# Altium project STM_Analog_Ascii.PrjPcb
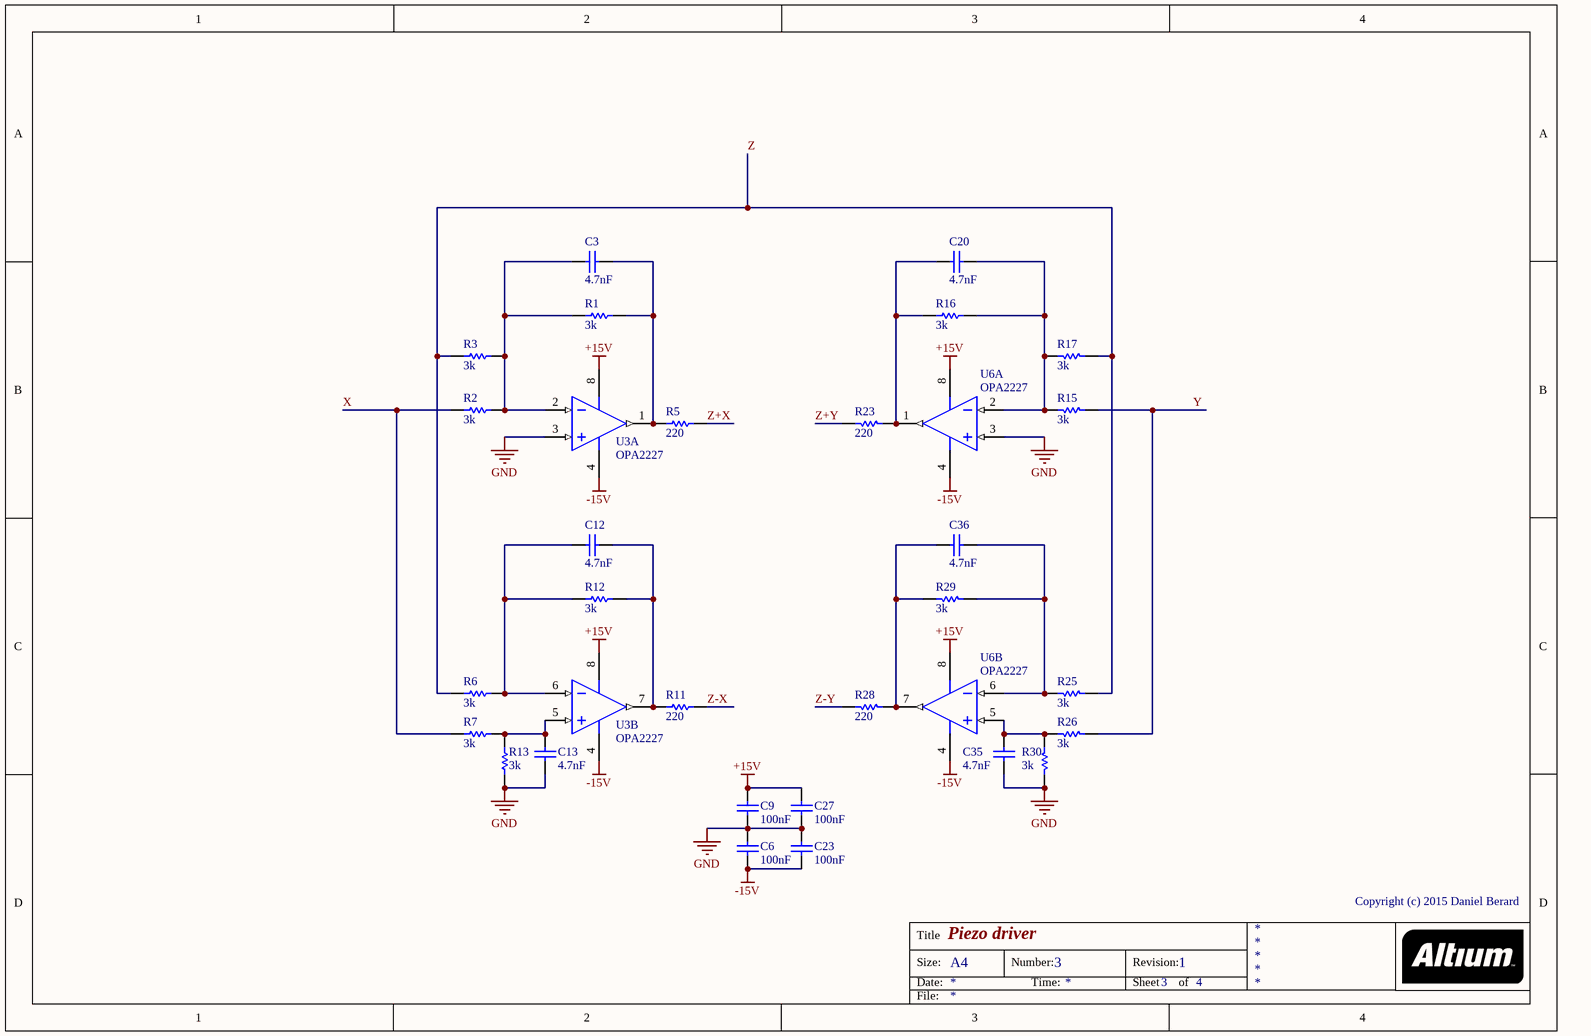
[diagram p0: Piezo Driver.SchDoc]
4 sheets, 136 parts. Net scope: global (net labels, ports and power ports of the same name join across sheets).
Board file: STM.PcbDoc
Sheets:
  Piezo Driver.SchDoc
  DAC.SchDoc
  ADC.SchDoc
  Connectors.SchDoc

## Sheet Piezo Driver.SchDoc: Piezo driver
size A4; DrawnBy: Daniel Berard; Engineer: Daniel Berard; DocumentNumber: 3; Revision: 1; SheetNumber: 3; SheetTotal: 4; ProjectName: STM

### Parts
C3  4.7nF  [6-0805_N]
C6  100nF  [6-0805_N]
C9  100nF  [6-0805_N]
C12  4.7nF  [6-0805_N]
C13  4.7nF  [6-0805_N]
C20  4.7nF  [6-0805_N]
C23  100nF  [6-0805_N]
C27  100nF  [6-0805_N]
C35  4.7nF  [6-0805_N]
C36  4.7nF  [6-0805_N]
R1  3k  [6-0805_N]
R2  3k  [6-0805_N]
R3  3k  [6-0805_N]
R5  220  [6-0805_N]
R6  3k  [6-0805_N]
R7  3k  [6-0805_N]
R11  220  [6-0805_N]
R12  3k  [6-0805_N]
R13  3k  [6-0805_N]
R15  3k  [6-0805_N]
R16  3k  [6-0805_N]
R17  3k  [6-0805_N]
R23  220  [6-0805_N]
R25  3k  [6-0805_N]
R26  3k  [6-0805_N]
R28  220  [6-0805_N]
R29  3k  [6-0805_N]
R30  3k  [6-0805_N]
U3  OPA2227  [ADI-R-8_M]  (parts A,B of 2)
U6  OPA2227  [ADI-R-8_M]  (parts A,B of 2)

### Nets
+15V: C9.2 C27.2 U3.8(+V) U6.8(+V)
-15V: C6.1 C23.1 U3.4(-V) U6.4(-V)
GND: C6.2 C9.1 C13.1 C23.2 C27.1 C35.1 R13.1 R30.1 U3.3(+IN_A) U6.3(+IN_A)
X: R2.1 R7.1
Y: R15.1 R26.1
Z: R3.1 R6.1 R17.1 R25.1
Z+X: R5.2
Z+Y: R23.2
Z-X: R11.2
Z-Y: R28.2
NetC3_1: C3.1 R1.1 R2.2 R3.2 U3.2(-IN_A)
NetC3_2: C3.2 R1.2 R5.1 U3.1(OUT_A)
NetC12_1: C12.1 R6.2 R12.1 U3.6(-IN_B)
NetC12_2: C12.2 R11.1 R12.2 U3.7(OUT_B)
NetC13_2: C13.2 R7.2 R13.2 U3.5(+IN_B)
NetC20_1: C20.1 R16.1 R23.1 U6.1(OUT_A)
NetC20_2: C20.2 R15.2 R16.2 R17.2 U6.2(-IN_A)
NetC35_2: C35.2 R26.2 R30.2 U6.5(+IN_B)
NetC36_1: C36.1 R28.1 R29.2 U6.7(OUT_B)
NetC36_2: C36.2 R25.2 R29.1 U6.6(-IN_B)

### Notes on the sheet
- Copyright (c) 2015 Daniel Berard
- Title
- Size:
- Date:
- A4
- Number:
- Time:
- Revision:
- Sheet
- of
- File:

### Library data of the parts
C3 C6 C9 C12 C13 C20 C23 C27 C35 C36 = Cap: Capacitor; Value: 100pF; Published: 8-Jun-2000; LatestRevisionDate: 17-Jul-2002; LatestRevisionNote: Re-released for DXP Platform.; PackageReference: RAD-0.3; Publisher: Altium Limited; PackageDescription: Radial Cap, Thru-Hole; 2 Leads; 0.3 in Pin Spacing
R1-R3 R5-R7 R11-R13 R15-R17 R23 R25 R26 R28-R30 = Res1: Resistor; Value: 1K; Published: 8-Jun-2000; LatestRevisionDate: 17-Jul-2002; LatestRevisionNote: Re-released for DXP Platform.; PackageReference: AXIAL-0.3; Publisher: Altium Limited; PackageDescription: Axial Device, Thru-Hole; 2 Leads; 0.3 in Pin Spacing
U3 U6 = CMP-0384-01147-2: Double Channel Wide Bandwidth Operational Amplifier, 10 MHz BW, 2.5 V/us SR, Industrial, 8-pin SOIC (R-8), Tube; Manufacturer: Analog Devices; Generic Part Number: AD8676; PartNumber: AD8676BRZ; V Span Min: 10V; Input Offset Voltage: 12uV; V Span Max: 36V; Iq/Amp: 2.7mA; Input Bias Current: 2.4nA; Small Signal Bandwidth: 10MHz; Amplifiers Per Package: 2; ComponentLink2Description: Datasheet; RevisionNote: Reference Circuit URL fixed; ComponentLink4URL: http://www.analog.com/en/all-operational-amplifiers-op-amps/operational-amplifiers-op-amps/ad8676/products/product.html#product-recommendations; Code_JEDEC: MS-012-AA; PackageDescription: 8-Pin Standard Small Outline Package, Body 3.9 x 4.9 mm, Pitch 1.27 mm; Mounting Technology: Surface Mount; Slew Rate: 2.5V/us; ComponentLink4Description: Reference Circuit; PackageVersion: 060506-A; ComponentLink1URL: http://www.analog.com/en/index.html; ComponentLink2URL: http://www.analog.com/static/imported-files/data_sheets/AD8676.pdf; ComponentLink1Description: Manufacturer URL; ComponentLink3Description: Package Specification; DatasheetVersion: Rev. C; ComponentLink3URL: http://www.analog.com/static/imported-files/packages/PKG_PDF/SOIC_Narrow%20(R)/R_8.pdf; PackageReference: R-8

## Sheet DAC.SchDoc: Analog outputs
size A3; DrawnBy: Daniel Berard; Engineer: Daniel Berard; DocumentNumber: 2; Revision: 1; SheetNumber: 2; SheetTotal: 4; ProjectName: STM
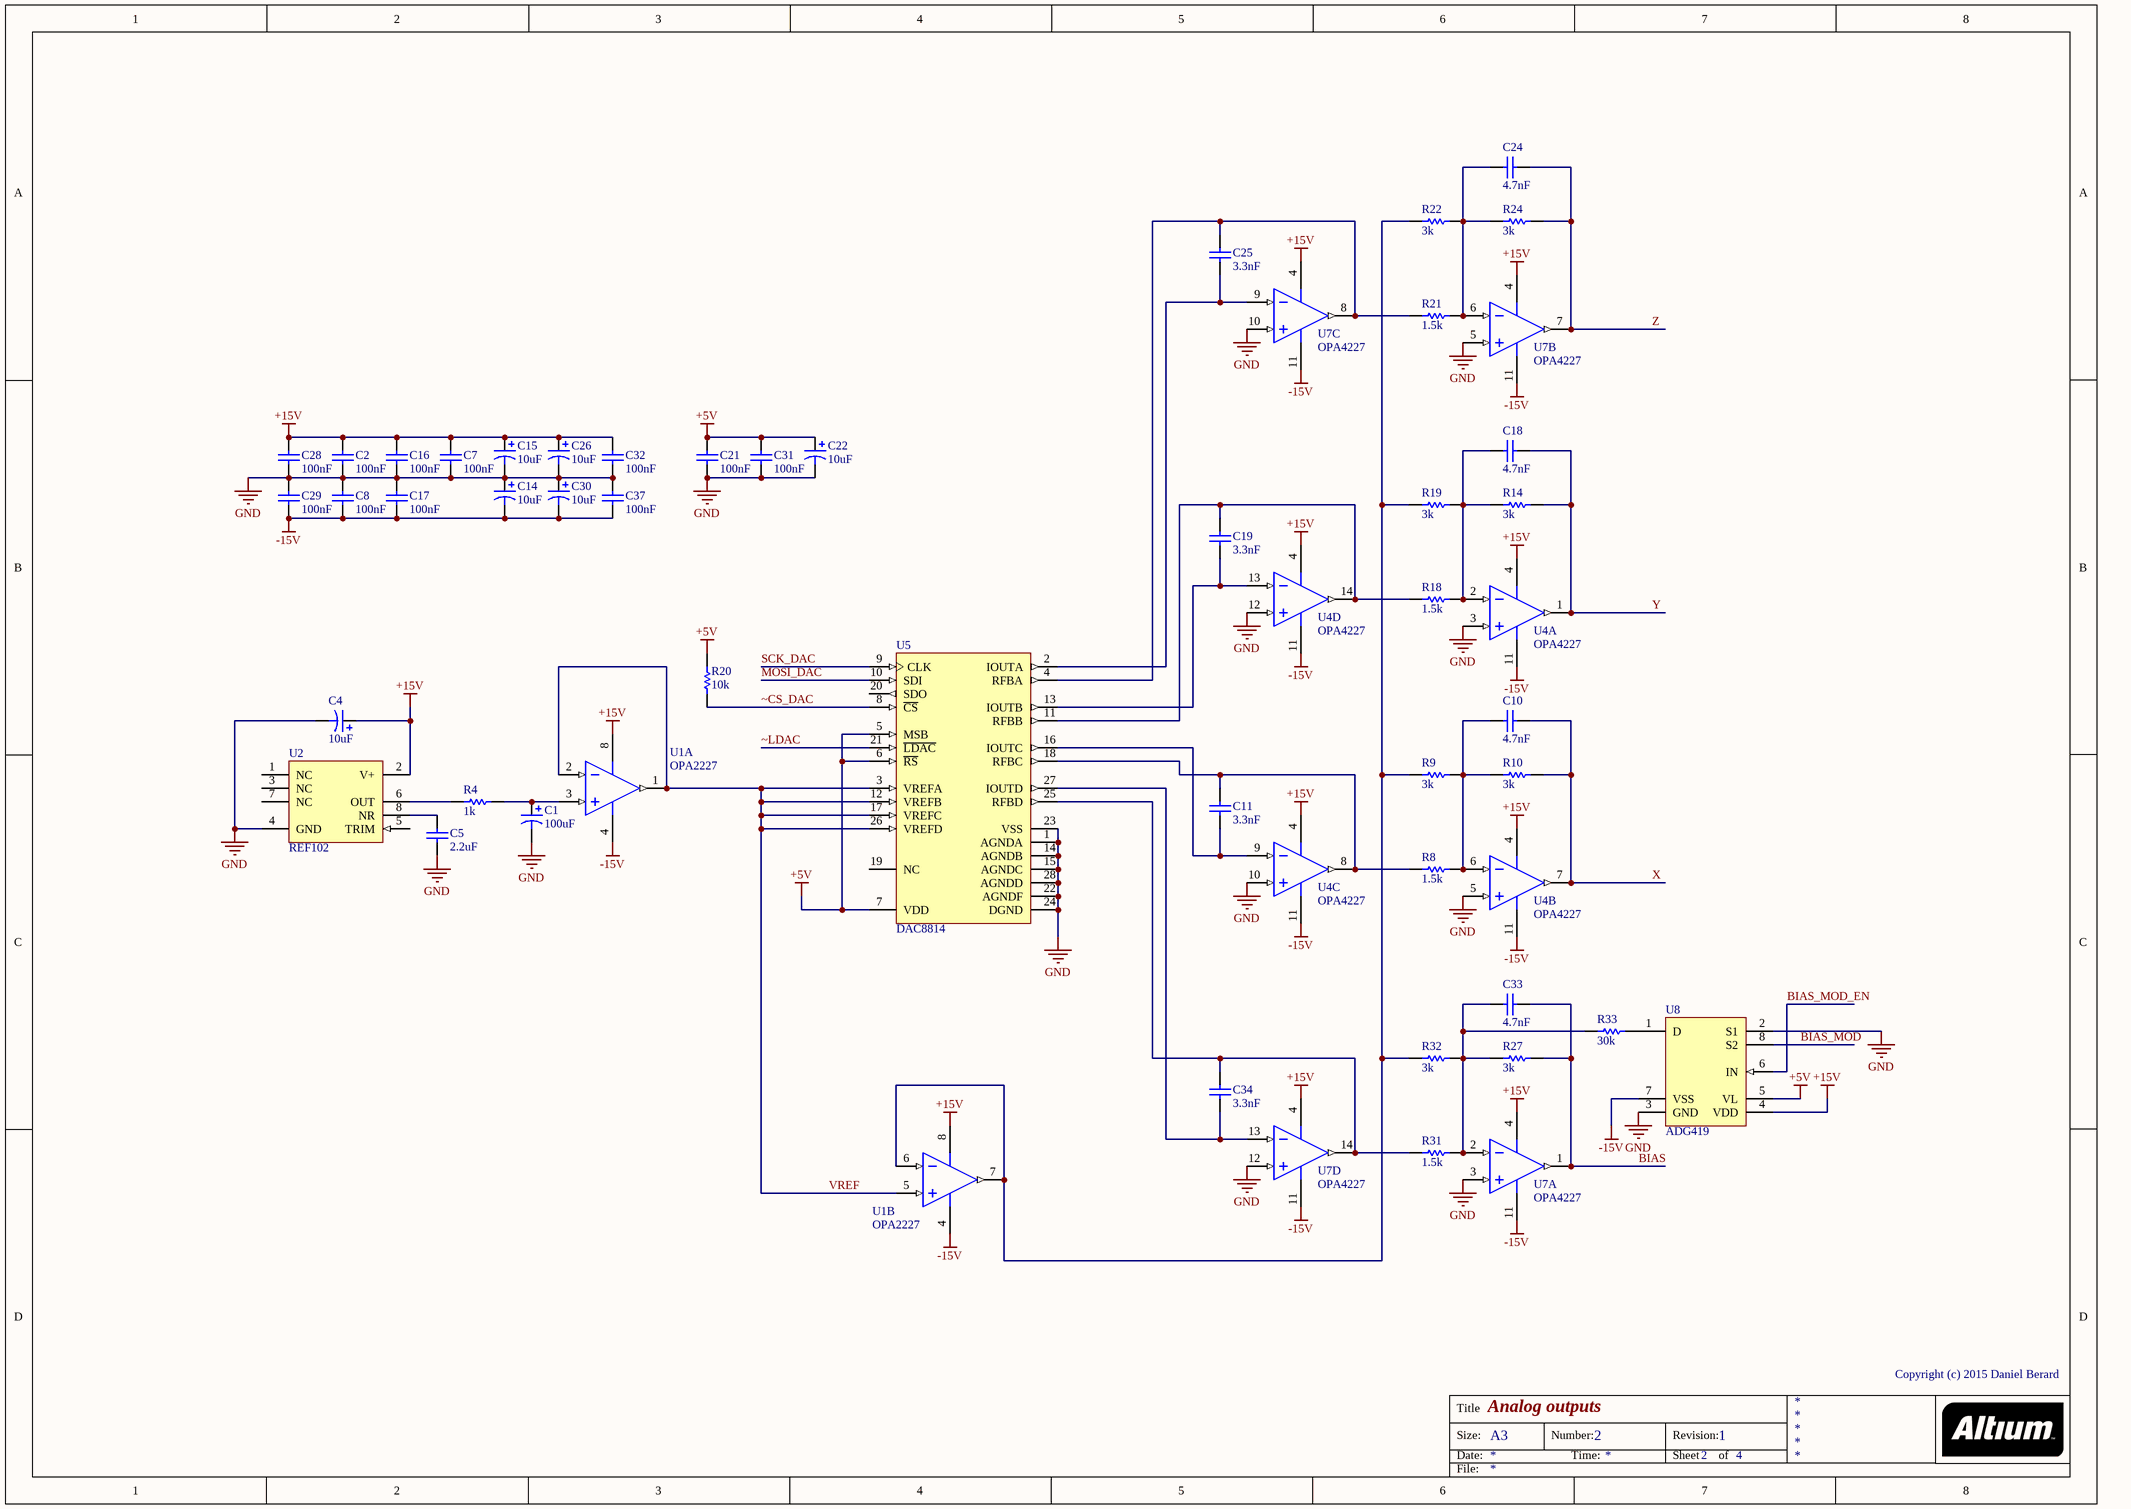
[diagram p1: DAC.SchDoc]

### Parts
C1  100uF  [7343]
C2  100nF  [6-0805_N]
C4  10uF  [3528]
C5  2.2uF  [C1206]
C7  100nF  [6-0805_N]
C8  100nF  [6-0805_N]
C10  4.7nF  [6-0805_N]
C11  3.3nF  [6-0805_N]
C14  10uF  [3528]
C15  10uF  [3528]
C16  100nF  [6-0805_N]
C17  100nF  [6-0805_N]
C18  4.7nF  [6-0805_N]
C19  3.3nF  [6-0805_N]
C21  100nF  [6-0805_N]
C22  10uF  [6-0805_N]
C24  4.7nF  [6-0805_N]
C25  3.3nF  [6-0805_N]
C26  10uF  [3528]
C28  100nF  [6-0805_N]
C29  100nF  [6-0805_N]
C30  10uF  [3528]
C31  100nF  [6-0805_N]
C32  100nF  [6-0805_N]
C33  4.7nF  [6-0805_N]
C34  3.3nF  [6-0805_N]
C37  100nF  [6-0805_N]
R4  1k  [6-0805_N]
R8  1.5k  [6-0805_N]
R9  3k  [6-0805_N]
R10  3k  [6-0805_N]
R14  3k  [6-0805_N]
R18  1.5k  [6-0805_N]
R19  3k  [6-0805_N]
R20  10k  [6-0805_N]
R21  1.5k  [6-0805_N]
R22  3k  [6-0805_N]
R24  3k  [6-0805_N]
R27  3k  [6-0805_N]
R31  1.5k  [6-0805_N]
R32  3k  [6-0805_N]
R33  30k  [6-0805_N]
U1  OPA2227  [ADI-R-8_M]  (parts A,B of 2)
U2  REF102  [182H_N]
U4  OPA4227  [TI-D14_M]  (parts A,B,C,D of 4)
U5  DAC8814  [TI-DB28_L]
U7  OPA4227  [TI-D14_M]  (parts A,B,C,D of 4)
U8  ADG419  [ADI-RM-8_N]

### Nets
+5V: C21.2 C22.1 C31.2 R20.2 U5.5(MSB) U5.6(~{RS}) U5.7(VDD) U8.5(VL)
+15V: C2.2 C4.1 C7.1 C15.1 C16.2 C26.1 C28.2 C32.2 U1.8(+V) U2.2(V+) U4.4(V+) U7.4(V+) U8.4(VDD)
-15V: C8.1 C14.2 C17.1 C29.1 C30.2 C37.1 U1.4(-V) U4.11(V-) U7.11(V-) U8.7(VSS)
GND: C1.2 C2.1 C4.2 C5.2 C7.2 C8.2 C14.1 C15.2 C16.1 C17.2 C21.1 C22.2 C26.2 C28.1 C29.2 C30.1 C31.1 C32.1 C37.2 U2.4(GND) U4.3(IN_A+) U4.5(IN_B+) U4.10(IN_C+) U4.12(IN_D+) U5.1(AGNDA) U5.14(AGNDB) U5.15(AGNDC) U5.22(AGNDF) U5.23(VSS) U5.24(DGND) U5.28(AGNDD) U7.3(IN_A+) U7.5(IN_B+) U7.10(IN_C+) U7.12(IN_D+) U8.2(S1) U8.3(GND)
BIAS: C33.2 R27.2 U7.1(OUT_A)
BIAS_MOD: U8.8(S2)
BIAS_MOD_EN: U8.6(IN)
MOSI_DAC: U5.10(SDI)
SCK_DAC: U5.9(CLK)
VREF: U1.1(OUT_A) U1.2(-IN_A) U1.5(+IN_B) U5.3(VREFA) U5.12(VREFB) U5.17(VREFC) U5.26(VREFD)
X: C10.2 R10.2 U4.7(OUT_B)
Y: C18.2 R14.2 U4.1(OUT_A)
Z: C24.2 R24.2 U7.7(OUT_B)
~CS_DAC: R20.1 U5.8(~{CS})
~LDAC: U5.21(~{LDAC})
NetC1_1: C1.1 R4.2 U1.3(+IN_A)
NetC5_1: C5.1 U2.8(NR)
NetC10_1: C10.1 R8.2 R9.2 R10.1 U4.6(IN_B-)
NetC11_1: C11.1 U4.9(IN_C-) U5.16(IOUTC)
NetC11_2: C11.2 R8.1 U4.8(OUT_C) U5.18(RFBC)
NetC18_1: C18.1 R14.1 R18.2 R19.2 U4.2(IN_A-)
NetC19_1: C19.1 U4.13(IN_D-) U5.13(IOUTB)
NetC19_2: C19.2 R18.1 U4.14(OUT_D) U5.11(RFBB)
NetC24_1: C24.1 R21.2 R22.2 R24.1 U7.6(IN_B-)
NetC25_1: C25.1 U5.2(IOUTA) U7.9(IN_C-)
NetC25_2: C25.2 R21.1 U5.4(RFBA) U7.8(OUT_C)
NetC33_1: C33.1 R27.1 R31.2 R32.2 R33.1 U7.2(IN_A-)
NetC34_1: C34.1 U5.27(IOUTD) U7.13(IN_D-)
NetC34_2: C34.2 R31.1 U5.25(RFBD) U7.14(OUT_D)
NetR4_1: R4.1 U2.6(OUT)
NetR9_1: R9.1 R19.1 R22.1 R32.1 U1.6(-IN_B) U1.7(OUT_B)
NetR33_2: R33.2 U8.1(D)

Not connected (* = marked no-connect by the designer): U2 1(NC) 3(NC) 5(TRIM) 7(NC); U5 19(NC) 20(SDO)

### Notes on the sheet
- Copyright (c) 2015 Daniel Berard
- Title
- Size:
- Date:
- A3
- Number:
- Time:
- Revision:
- Sheet
- of
- File:

### Library data of the parts
C1 C4 C14 C15 C22 C26 C30 = Cap Pol1: Polarized Capacitor (Radial); Value: 100pF; Published: 8-Jun-2000; LatestRevisionDate: 17-Jul-2002; LatestRevisionNote: Re-released for DXP Platform.; PackageReference: RB7.6-15; Publisher: Altium Limited; PackageDescription: Polarized Capacitor (Radial); 2 Leads
C2 C5 C7 C8 C10 C11 C16-C19 C21 C24 C25 C28 C29 C31-C34 C37 = Cap: Capacitor; Value: 100pF; Published: 8-Jun-2000; LatestRevisionDate: 17-Jul-2002; LatestRevisionNote: Re-released for DXP Platform.; PackageReference: RAD-0.3; Publisher: Altium Limited; PackageDescription: Radial Cap, Thru-Hole; 2 Leads; 0.3 in Pin Spacing
R4 = Res1: Resistor; Published: 8-Jun-2000; LatestRevisionDate: 17-Jul-2002; LatestRevisionNote: Re-released for DXP Platform.; PackageReference: AXIAL-0.3; Publisher: Altium Limited; PackageDescription: Axial Device, Thru-Hole; 2 Leads; 0.3 in Pin Spacing; Value: 1K
R8-R10 R14 R18-R22 R24 R27 R31-R33 = Res1: Resistor; Value: 1K; Published: 8-Jun-2000; LatestRevisionDate: 17-Jul-2002; LatestRevisionNote: Re-released for DXP Platform.; PackageReference: AXIAL-0.3; Publisher: Altium Limited; PackageDescription: Axial Device, Thru-Hole; 2 Leads; 0.3 in Pin Spacing
U1 = CMP-0384-01147-2: as U3 on sheet Piezo Driver; ComponentLink2Description: Datasheet; RevisionNote: Reference Circuit URL fixed; ComponentLink4URL: http://www.analog.com/en/all-operational-amplifiers-op-amps/operational-amplifiers-op-amps/ad8676/products/product.html#product-recommendations; Code_JEDEC: MS-012-AA; PackageDescription: 8-Pin Standard Small Outline Package, Body 3.9 x 4.9 mm, Pitch 1.27 mm; Mounting Technology: Surface Mount; Slew Rate: 2.5V/us; ComponentLink4Description: Reference Circuit; PackageVersion: 060506-A; ComponentLink1URL: http://www.analog.com/en/index.html; ComponentLink2URL: http://www.analog.com/static/imported-files/data_sheets/AD8676.pdf; ComponentLink1Description: Manufacturer URL; ComponentLink3Description: Package Specification; DatasheetVersion: Rev. C; ComponentLink3URL: http://www.analog.com/static/imported-files/packages/PKG_PDF/SOIC_Narrow%20(R)/R_8.pdf; PackageReference: R-8
U2 = REF102AU: Precision Voltage Reference; Note: Pins 1,3 and 7 are No internal Connection (NC) pins.; Published: 8-Jun-2000; LatestRevisionDate: 13-Apr-2006; LatestRevisionNote: IPC-7351 Footprint Added.; DatasheetVersion: Oct-1993; PackageReference: 182H; Publisher: Altium Limited; PackageDescription: 8-Pin Small Outline Integrated Circuit 1.27 mm Pitch; Code_JEDEC: MS-012-AA; Code_IPC: SOIC127P600-8; ComponentLink1Description: Manufacturer Link; ComponentLink1URL: http://www.ti.com/; ComponentLink2Description: Datasheet; ComponentLink2URL: http://www-s.ti.com/sc/ds/REF102.pdf
U4 U7 = CMP-0272-00152-2: High Precision, Low Noise Operational Amplifier, 5 to 36 V, -40 to 85 degC, 14-pin SOIC (D14), Green (RoHS & no Sb/Br); PartNumber: OPA4227UA/2K5; Manufacturer: Texas Instruments; Offset Drift(Typ)(uV/C): 0.3; Total Supply Voltage(Max)(+5V is 5, +/-5V is 10): 36; Vio (25C)(Max)(mV): 0.2; CMRR(Min)(dB): 120; Iq per channel(Max)(mA): 3.8; GBW(Typ)(MHz): 8; Number of Channels: 4; Rating: Catalog; IIB(Max)(pA): 10000; Slew Rate(Typ)(V/us): 2.3; Total Supply Voltage(Min)(+5V is 5, +/-5V is 10): 5; Packing: LARGE T&R; Sub Family: High Supply Voltage Amplifier (>=30V), Low Noise Amp (<=10nV/rtHz), Low Offset Voltage Amplifier (<=500uV), Precision Amplifier; PackageReference: D14; ComponentLink2Description: Datasheet; ComponentLink3URL: http://www.ti.com/lit/ml/mpds177g/mpds177g.pdf; Code_JEDEC: MS-012; DatasheetVersion: SBOS110A; Eco-Plan: Green (RoHS & no Sb/Br); ComponentLink3Description: Package Specification; ComponentLink2URL: http://www.ti.com/lit/ds/symlink/opa4227.pdf; ComponentLink1URL: http://www.ti.com/; Mounting Technology: Surface Mount; PackageDescription: 14-Pin Plastic Small Outline, Body 8.65 x 3.9 mm, Pitch 1.27 mm; PackageVersion: 4040047-5/M, 06/2011; ComponentLink1Description: Manufacturer URL
U5 = CMP-0004-00286-1: 16-Bit, Quad, Serial Input Multiplying Digital to Analog Converter, -40 to 85 degC, 28-pin SOP (DB28), Green (RoHS & no Sb/Br); Manufacturer: Texas Instruments; PartNumber: DAC8814ICDBTG4; Resolution(Bits): 16; DAC Channels: 4; SubFamily: Precision DAC (=<10MSPS); INL(Max)(+/-LSB): 1; Settling Time(us): 0.5; Interface: Serial SPI; Eco-Plan: Green (RoHS & no Sb/Br); PackageReference: DB28; ComponentLink1URL: http://www.ti.com/; DatasheetVersion: SBAS338D; PackageDescription: 28-Pin Plastic Small Outline, Body 10.2 X 5.3 mm, Pitch 0.65 mm; ComponentLink3Description: Package Specification; ComponentLink3URL: http://www.ti.com/lit/ml/msso002e/msso002e.pdf; ComponentLink2Description: Datasheet; Code_JEDEC: MO-150; ComponentLink2URL: http://www.ti.com/general/docs/lit/getliterature.tsp?genericPartNumber=DAC8814&fileType=pdf; ComponentLink1Description: Manufacturer URL; PackageVersion: 4040065/E, 12/2001; Mounting Technology: Surface Mount; DNL(Max)(+/-LSB): 1
U8 = CMP-0792-00196-1: LC2MOS Precision Mini-DIP Analog Switches, 25 Ohm Ron, 8-pin SOP (RM-8), Tube; Manufacturer: Analog Devices; PartNumber: ADG419BRMZ; Ron (ohms): 25, 40; Configuration: SPDT; Max Pos Supply: +16.5V; # Sw Functions: 1; Max Neg Supply: -16.5V; ComponentLink2Description: Datasheet; DatasheetVersion: Rev. C; Code_JEDEC: MO-187-AA; PackageVersion: Aug-05; ComponentLink1Description: Manufacturer URL; Mounting Technology: Surface Mount; ComponentLink3URL: http://www.analog.com/static/imported-files/packages/PKG_PDF/MSOP%28RM%29/RM_8.pdf; Packing: Tube; ComponentLink1URL: http://www.analog.com/en/index.html; ComponentLink3Description: Package Specification; PackageDescription: 8-Pin Mini Small Outline Package, Body 3 x 3 mm, Pitch 0.65 mm; PackageReference: RM-8; ComponentLink2URL: http://www.analog.com/static/imported-files/data_sheets/ADG419.pdf

## Sheet ADC.SchDoc: Data acquisition
size A4; DrawnBy: Daniel Berard; Engineer: Daniel Berard; DocumentNumber: 1; Revision: 1; SheetNumber: 1; SheetTotal: 4; ProjectName: STM
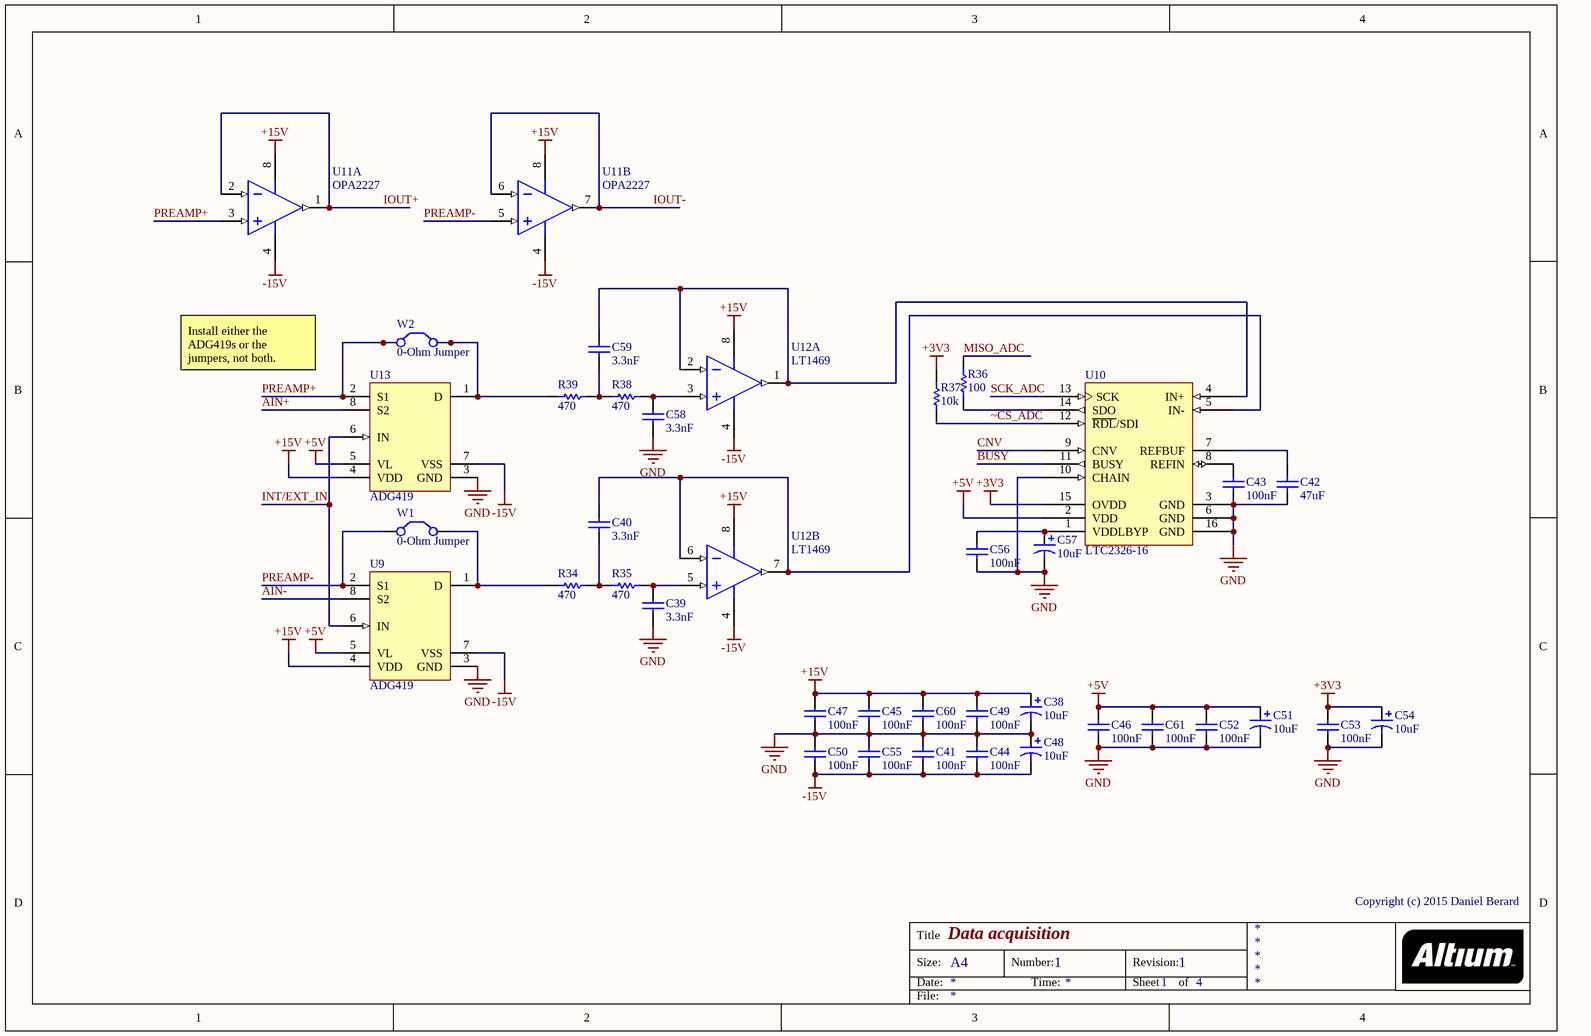
[diagram p2: ADC.SchDoc]

### Parts
C38  10uF  [3528]
C39  3.3nF  [6-0805_N]
C40  3.3nF  [6-0805_N]
C41  100nF  [6-0805_N]
C42  47uF  [C1210]
C43  100nF  [6-0805_N]
C44  100nF  [6-0805_N]
C45  100nF  [6-0805_N]
C46  100nF  [6-0805_N]
C47  100nF  [6-0805_N]
C48  10uF  [3528]
C49  100nF  [6-0805_N]
C50  100nF  [6-0805_N]
C51  10uF  [6-0805_N]
C52  100nF  [6-0805_N]
C53  100nF  [6-0805_N]
C54  10uF  [6-0805_N]
C55  100nF  [6-0805_N]
C56  100nF  [6-0805_N]
C57  10uF  [6-0805_N]
C58  3.3nF  [6-0805_N]
C59  3.3nF  [6-0805_N]
C60  100nF  [6-0805_N]
C61  100nF  [6-0805_N]
R34  470  [6-0805_N]
R35  470  [6-0805_N]
R36  100  [6-0805_N]
R37  10k  [6-0805_N]
R38  470  [6-0805_N]
R39  470  [6-0805_N]
U9  ADG419  [ADI-RM-8_N]
U10  LTC2326-16  [MSOP-16]
U11  OPA2227  [TI-D8_N]  (parts A,B of 2)
U12  LT1469  [LT-S8-8_N]  (parts A,B of 2)
U13  ADG419  [ADI-RM-8_N]
W1  0-Ohm Jumper  [6-0805_N]
W2  0-Ohm Jumper  [6-0805_N]

### Nets
+3V3: C53.2 C54.1 R37.2 U10.15(OVDD)
+5V: C46.2 C51.1 C52.2 C61.2 U9.5(VL) U10.2(VDD) U13.5(VL)
+15V: C38.1 C45.2 C47.2 C49.2 C60.2 U9.4(VDD) U11.8(V+) U12.8(V+) U13.4(VDD)
-15V: C41.1 C44.1 C48.2 C50.1 C55.1 U9.7(VSS) U11.4(V-) U12.4(V-) U13.7(VSS)
GND: C38.2 C39.2 C41.2 C42.1 C43.1 C44.2 C45.1 C46.1 C47.1 C48.1 C49.1 C50.2 C51.2 C52.1 C53.1 C54.2 C55.2 C56.1 C57.2 C58.2 C60.1 C61.1 U9.3(GND) U10.3(GND) U10.6(GND) U10.10(CHAIN) U10.16(GND) U13.3(GND)
AIN+: U13.8(S2)
AIN-: U9.8(S2)
BUSY: U10.11(BUSY)
CNV: U10.9(CNV)
INT/EXT_IN: U9.6(IN) U13.6(IN)
IOUT+: U11.1(OUT_A) U11.2(IN_A-)
IOUT-: U11.6(IN_B-) U11.7(OUT_B)
MISO_ADC: R36.1
PREAMP+: U11.3(IN_A+) U13.2(S1) W2.1(C1)
PREAMP-: U9.2(S1) U11.5(IN_B+) W1.1(C1)
SCK_ADC: U10.13(SCK)
~CS_ADC: R37.1 U10.12(~{RDL}/SDI)
NetC39_1: C39.1 R35.2 U12.5(+IN_B)
NetC40_1: C40.1 U10.5(IN-) U12.6(-IN_B) U12.7(OUT_B)
NetC40_2: C40.2 R34.2 R35.1
NetC42_2: C42.2 U10.7(REFBUF)
NetC43_2: C43.2 U10.8(REFIN)
NetC56_2: C56.2 C57.1 U10.1(VDDLBYP)
NetC58_1: C58.1 R38.2 U12.3(+IN_A)
NetC59_1: C59.1 U10.4(IN+) U12.1(OUT_A) U12.2(-IN_A)
NetC59_2: C59.2 R38.1 R39.2
NetR34_1: R34.1 U9.1(D) W1.2(C2)
NetR36_2: R36.2 U10.14(SDO)
NetR39_1: R39.1 U13.1(D) W2.2(C2)

### Notes on the sheet
- Install either the ADG419s or the jumpers, not both.
- Copyright (c) 2015 Daniel Berard
- Title
- Size:
- Date:
- A4
- Number:
- Time:
- Revision:
- Sheet
- of
- File:

### Library data of the parts
C38 C48 C51 C54 C57 = Cap Pol1: as C1 on sheet DAC; Published: 8-Jun-2000; LatestRevisionDate: 17-Jul-2002; LatestRevisionNote: Re-released for DXP Platform.; PackageReference: RB7.6-15; Publisher: Altium Limited; PackageDescription: Polarized Capacitor (Radial); 2 Leads
C39-C47 C49 C50 C52 C53 C55 C56 C58-C61 = Cap: Capacitor; Value: 100pF; Published: 8-Jun-2000; LatestRevisionDate: 17-Jul-2002; LatestRevisionNote: Re-released for DXP Platform.; PackageReference: RAD-0.3; Publisher: Altium Limited; PackageDescription: Radial Cap, Thru-Hole; 2 Leads; 0.3 in Pin Spacing
R34-R39 = Res1: Resistor; Value: 1K; Published: 8-Jun-2000; LatestRevisionDate: 17-Jul-2002; LatestRevisionNote: Re-released for DXP Platform.; PackageReference: AXIAL-0.3; Publisher: Altium Limited; PackageDescription: Axial Device, Thru-Hole; 2 Leads; 0.3 in Pin Spacing
U9 U13 = CMP-0792-00196-1: as U8 on sheet DAC; ComponentLink2Description: Datasheet; DatasheetVersion: Rev. C; Code_JEDEC: MO-187-AA; PackageVersion: Aug-05; ComponentLink1Description: Manufacturer URL; Mounting Technology: Surface Mount; ComponentLink3URL: http://www.analog.com/static/imported-files/packages/PKG_PDF/MSOP%28RM%29/RM_8.pdf; Packing: Tube; ComponentLink1URL: http://www.analog.com/en/index.html; ComponentLink3Description: Package Specification; PackageDescription: 8-Pin Mini Small Outline Package, Body 3 x 3 mm, Pitch 0.65 mm; PackageReference: RM-8; ComponentLink2URL: http://www.analog.com/static/imported-files/data_sheets/ADG419.pdf
U11 = CMP-0272-00267-2: High Precision, Low Noise Operational Amplifier, 5 to 36 V, -40 to 85 degC, 8-pin SOIC (D8), Green (RoHS & no Sb/Br); Manufacturer: Texas Instruments; PartNumber: OPA2227U/2K5; Rating: Catalog; Number of Channels: 2; IIB(Max)(pA): 10000; Packing: LARGE T&R; Total Supply Voltage(Max)(+5V is 5, +/-5V is 10): 36; GBW(Typ)(MHz): 8; CMRR(Min)(dB): 120; Offset Drift(Typ)(uV/C): 0.1; Iq per channel(Max)(mA): 3.8; Slew Rate(Typ)(V/us): 2.3; Total Supply Voltage(Min)(+5V is 5, +/-5V is 10): 5; Vio (25C)(Max)(mV): 0.075; Sub Family: High Supply Voltage Amplifier (>=30V), Low Noise Amp (<=10nV/rtHz), Low Offset Voltage Amplifier (<=500uV), Precision Amplifier; ComponentLink2URL: http://www.ti.com/lit/ds/symlink/opa2227.pdf; ComponentLink3Description: Package Specification; PackageDescription: 8-Pin Plastic Small Outline, Body 4.9 x 3.9 mm, Pitch 1.27 mm; Code_JEDEC: MS-012; PackageReference: D8; PackageVersion: 4040047-3/M, 06/2011; Mounting Technology: Surface Mount; DatasheetVersion: SBOS110A; ComponentLink2Description: Datasheet; ComponentLink3URL: http://www.ti.com/litv/pdf/msoi002j; ComponentLink1URL: http://www.ti.com/; Eco-Plan: Green (RoHS & no Sb/Br); ComponentLink1Description: Manufacturer URL
U12 = CMP-0359-02956-2: Dual Channel, 16-Bit Accurate Operational Amplifier, 200 MHz Typical GBW, 30 V/us Typical SR, 10 to 36 V, 8-Pin SOIC (S8-8), Commercial, Pb-Free; Linear Technology Part Number: LT1469-2; PartNumber: LT1469CS8-2#PBF; Manufacturer: Linear Technology; Vos (mV) Typical: 0.05; GBW (MHz) Typical: 200; Vs Min (V): 10; Channels (#): 2; Is (mA) Typical: 4.1; Vs Max (V): 36; SR (V/us) Typical: 30; ComponentLink1Description: Manufacturer URL; ComponentLink2Description: Datasheet; ComponentLink1URL: http://www.linear.com/; PackageReference: LT-S8-8; RoHS: Pb-Free; Mounting Technology: Surface Mount; Type: VFB; PackageDescription: 8-Pin Plastic Small Outline, Body 4.9 x 3.9 mm, Pitch 1.27 mm; PackageVersion: Rev G; ComponentLink3Description: Package Specification; ComponentLink2URL: http://cds.linear.com/docs/en/datasheet/14692f.pdf; ComponentLink3URL: http://cds.linear.com/docs/en/packaging/05081610_G_SO8.pdf; RevisionNote: URLs updated
W1 W2 = Jumper: Jumper Wire; Published: 24-Mar-1999; LatestRevisionDate: 17-Jul-2002; LatestRevisionNote: Re-released for DXP Platform.; PackageReference: RAD-0.2; Publisher: Altium Limited; PackageDescription: Radial Cap, Thru-Hole; 2 Leads; 0.2 in Pin Spacing

## Sheet Connectors.SchDoc: Connectors and power filtering
size A4; Author: Daniel Berard; DrawnBy: Daniel Berard; Engineer: Daniel Berard; DocumentNumber: 4; Revision: 1; SheetNumber: 4; SheetTotal: 4; ProjectName: STM
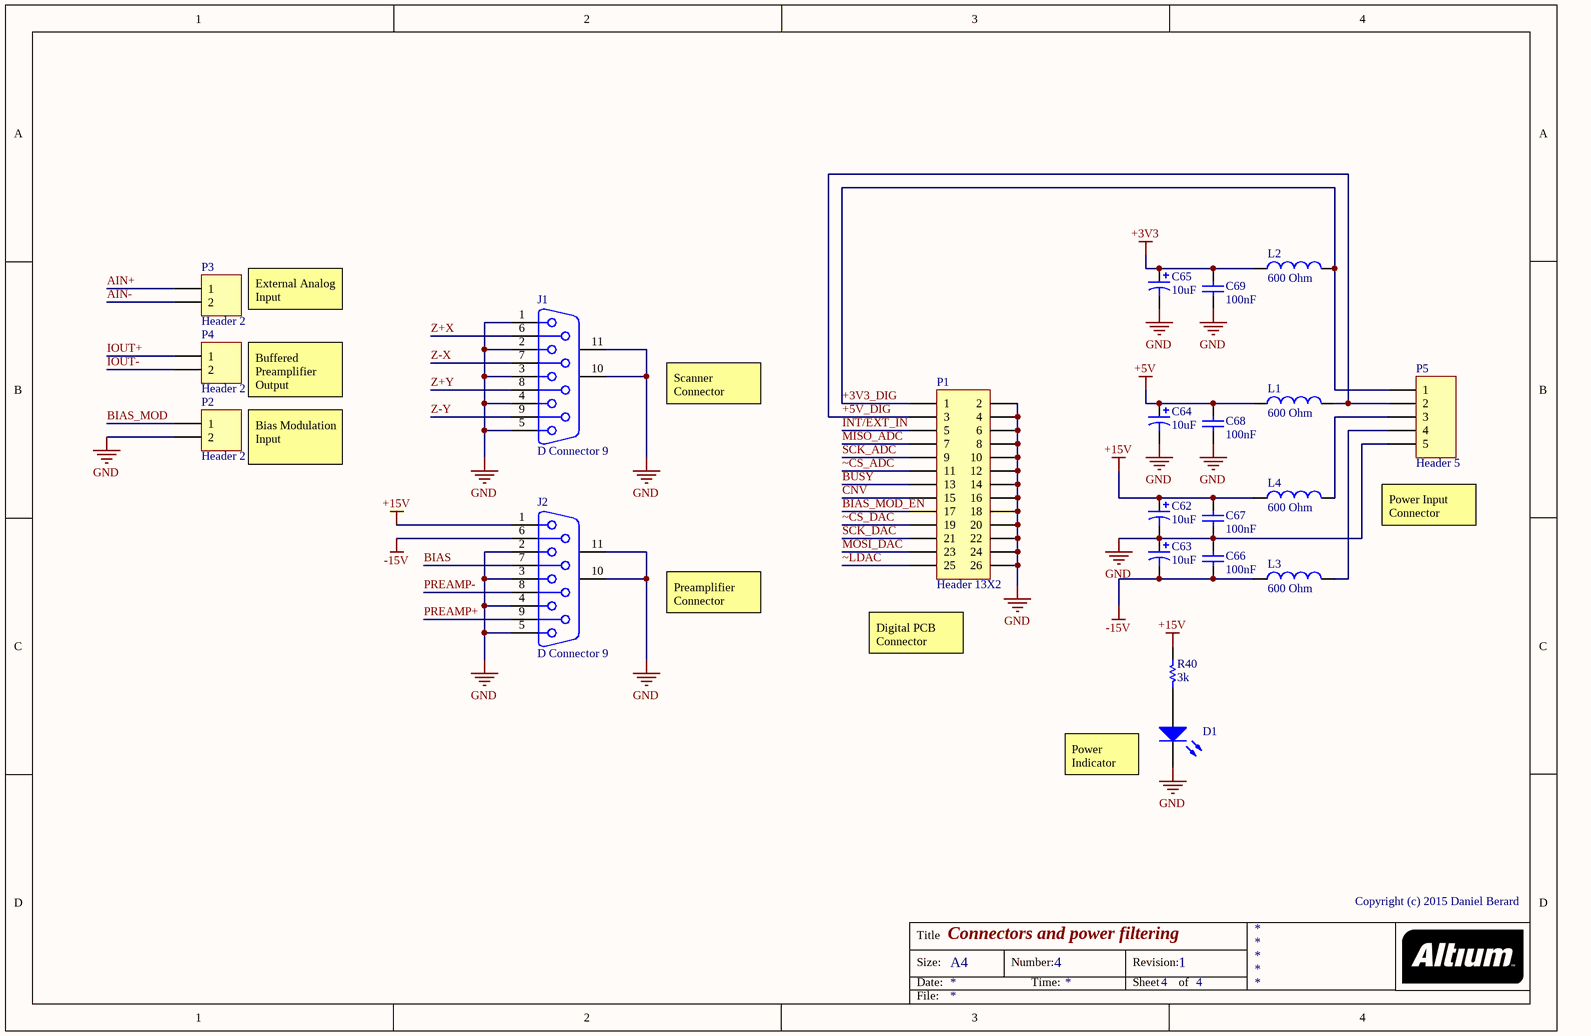
[diagram p3: Connectors.SchDoc]

### Parts
C62  10uF  [3528]
C63  10uF  [3528]
C64  10uF  [6-0805_N]
C65  10uF  [6-0805_N]
C66  100nF  [6-0805_N]
C67  100nF  [6-0805_N]
C68  100nF  [6-0805_N]
C69  100nF  [6-0805_N]
D1  (no value)  [6-0805_N]
J1  D Connector 9  [DSUB1.385-2H9]
J2  D Connector 9  [DSUB1.385-2H9]
L1  600 Ohm  [6-0805_N]
L2  600 Ohm  [6-0805_N]
L3  600 Ohm  [6-0805_N]
L4  600 Ohm  [6-0805_N]
P1  Header 13X2  [HDR2X13]
P2  Header 2  [HDR1X2]
P3  Header 2  [HDR1X2]
P4  Header 2  [HDR1X2]
P5  Header 5  [HDR1X5]
R40  3k  [6-0805_N]

### Nets
+3V3: C65.1 C69.1 L2.1
+5V: C64.1 C68.1 L1.1
+15V: C62.1 C67.1 J2.1 L4.1 R40.2
-15V: C63.2 C66.2 J2.6 L3.1
GND: C62.2 C63.1 C64.2 C65.2 C66.1 C67.2 C68.2 C69.2 D1.2(K) J1.1 J1.2 J1.3 J1.4 J1.5 J1.10(MH1) J1.11(MH2) J2.2 J2.3 J2.4 J2.5 J2.10(MH1) J2.11(MH2) P1.2 P1.4 P1.6 P1.8 P1.10 P1.12 P1.14 P1.16 P1.18 P1.20 P1.22 P1.24 P1.26 P2.2 P5.5
+3V3_DIG: L2.2 P1.1 P5.1
+5V_DIG: L1.2 P1.3 P5.2
AIN+: P3.1
AIN-: P3.2
BIAS: J2.7
BIAS_MOD: P2.1
BIAS_MOD_EN: P1.17
BUSY: P1.13
CNV: P1.15
INT/EXT_IN: P1.5
IOUT+: P4.1
IOUT-: P4.2
MISO_ADC: P1.7
MOSI_DAC: P1.23
PREAMP+: J2.9
PREAMP-: J2.8
SCK_ADC: P1.9
SCK_DAC: P1.21
Z+X: J1.6
Z+Y: J1.8
Z-X: J1.7
Z-Y: J1.9
~CS_ADC: P1.11
~CS_DAC: P1.19
~LDAC: P1.25
NetD1_1: D1.1(A) R40.1
NetL3_2: L3.2 P5.4
NetL4_2: L4.2 P5.3

### Notes on the sheet
- External Analog Input
- Buffered Preamplifier Output
- Scanner Connector
- Bias Modulation Input
- Power Input Connector
- Preamplifier Connector
- (near P1) Digital PCB Connector
- (near D1) Power Indicator
- Copyright (c) 2015 Daniel Berard
- Title
- Size:
- Date:
- A4
- Number:
- Time:
- Revision:
- Sheet
- of
- File:

### Library data of the parts
C62-C65 = Cap Pol1: as C1 on sheet DAC; Published: 8-Jun-2000; LatestRevisionDate: 17-Jul-2002; LatestRevisionNote: Re-released for DXP Platform.; PackageReference: RB7.6-15; Publisher: Altium Limited; PackageDescription: Polarized Capacitor (Radial); 2 Leads
C66-C69 = Cap: Capacitor; Value: 100pF; Published: 8-Jun-2000; LatestRevisionDate: 17-Jul-2002; LatestRevisionNote: Re-released for DXP Platform.; PackageReference: RAD-0.3; Publisher: Altium Limited; PackageDescription: Radial Cap, Thru-Hole; 2 Leads; 0.3 in Pin Spacing
D1 = LED0: Typical INFRARED GaAs LED; Published: 8-Jun-2000; LatestRevisionDate: 08-Jul-2005; LatestRevisionNote: Mech Layer 1 removed.; PackageReference: LED-0; Publisher: Altium Limited; PackageDescription: LED; 2 Leads
J1 J2 = D Connector 9: Receptacle Assembly, 9 Position, Right Angle; PackageDocument: O; Positions: 9; Published: 15-Jun-2001; LatestRevisionDate: 17-Jul-2002; LatestRevisionNote: Re-released for DXP Platform.; DatasheetDocument: 1-Sep-1999; PackageReference: 788750; Publisher: Altium Limited; Orientation: Right Angle; Gender: Receptacle
L1-L4 = Inductor: Code_IEC: 1005; Value: 10mH; Published: 8-Jun-2000; LatestRevisionDate: 29-May-2009; LatestRevisionNote: IPC-7351 Footprint Added.; PackageReference: 0402-A; Publisher: Altium Limited; PackageDescription: Chip Inductor; Code_JEITA: 0402
P1 = Header 13X2: Header, 13-Pin, Dual row; LatestRevisionDate: 17-Jul-2002; LatestRevisionNote: Re-released for DXP Platform.; Publisher: Altium Limited
P2-P4 = Header 2: Header, 2-Pin; LatestRevisionDate: 17-Jul-2002; LatestRevisionNote: Re-released for DXP Platform.; Publisher: Altium Limited
P5 = Header 5: Header, 5-Pin; LatestRevisionDate: 17-Jul-2002; LatestRevisionNote: Re-released for DXP Platform.; Publisher: Altium Limited
R40 = Res1: Resistor; Value: 1K; Published: 8-Jun-2000; LatestRevisionDate: 17-Jul-2002; LatestRevisionNote: Re-released for DXP Platform.; PackageReference: AXIAL-0.3; Publisher: Altium Limited; PackageDescription: Axial Device, Thru-Hole; 2 Leads; 0.3 in Pin Spacing

## Nets that join several sheets
+3V3: ADC (C53.2 C54.1 R37.2 U10.15), Connectors (C65.1 C69.1 L2.1)
+5V: DAC (8 pins), ADC (7 pins), Connectors (C64.1 C68.1 L1.1)
+15V: Piezo Driver (C9.2 C27.2 U3.8 U6.8), DAC (13 pins), ADC (9 pins), Connectors (5 pins)
-15V: Piezo Driver (C6.1 C23.1 U3.4 U6.4), DAC (10 pins), ADC (9 pins), Connectors (C63.2 C66.2 J2.6 L3.1)
GND: Piezo Driver (10 pins), DAC (37 pins), ADC (28 pins), Connectors (37 pins)
AIN+: ADC (U13.8), Connectors (P3.1)
AIN-: ADC (U9.8), Connectors (P3.2)
BIAS: DAC (C33.2 R27.2 U7.1), Connectors (J2.7)
BIAS_MOD: DAC (U8.8), Connectors (P2.1)
BIAS_MOD_EN: DAC (U8.6), Connectors (P1.17)
BUSY: ADC (U10.11), Connectors (P1.13)
CNV: ADC (U10.9), Connectors (P1.15)
INT/EXT_IN: ADC (U9.6 U13.6), Connectors (P1.5)
IOUT+: ADC (U11.1 U11.2), Connectors (P4.1)
IOUT-: ADC (U11.6 U11.7), Connectors (P4.2)
MISO_ADC: ADC (R36.1), Connectors (P1.7)
MOSI_DAC: DAC (U5.10), Connectors (P1.23)
PREAMP+: ADC (U11.3 U13.2 W2.1), Connectors (J2.9)
PREAMP-: ADC (U9.2 U11.5 W1.1), Connectors (J2.8)
SCK_ADC: ADC (U10.13), Connectors (P1.9)
SCK_DAC: DAC (U5.9), Connectors (P1.21)
X: Piezo Driver (R2.1 R7.1), DAC (C10.2 R10.2 U4.7)
Y: Piezo Driver (R15.1 R26.1), DAC (C18.2 R14.2 U4.1)
Z: Piezo Driver (R3.1 R6.1 R17.1 R25.1), DAC (C24.2 R24.2 U7.7)
Z+X: Piezo Driver (R5.2), Connectors (J1.6)
Z+Y: Piezo Driver (R23.2), Connectors (J1.8)
Z-X: Piezo Driver (R11.2), Connectors (J1.7)
Z-Y: Piezo Driver (R28.2), Connectors (J1.9)
~CS_ADC: ADC (R37.1 U10.12), Connectors (P1.11)
~CS_DAC: DAC (R20.1 U5.8), Connectors (P1.19)
~LDAC: DAC (U5.21), Connectors (P1.25)